# Altium project PCB_Project.PrjPcb
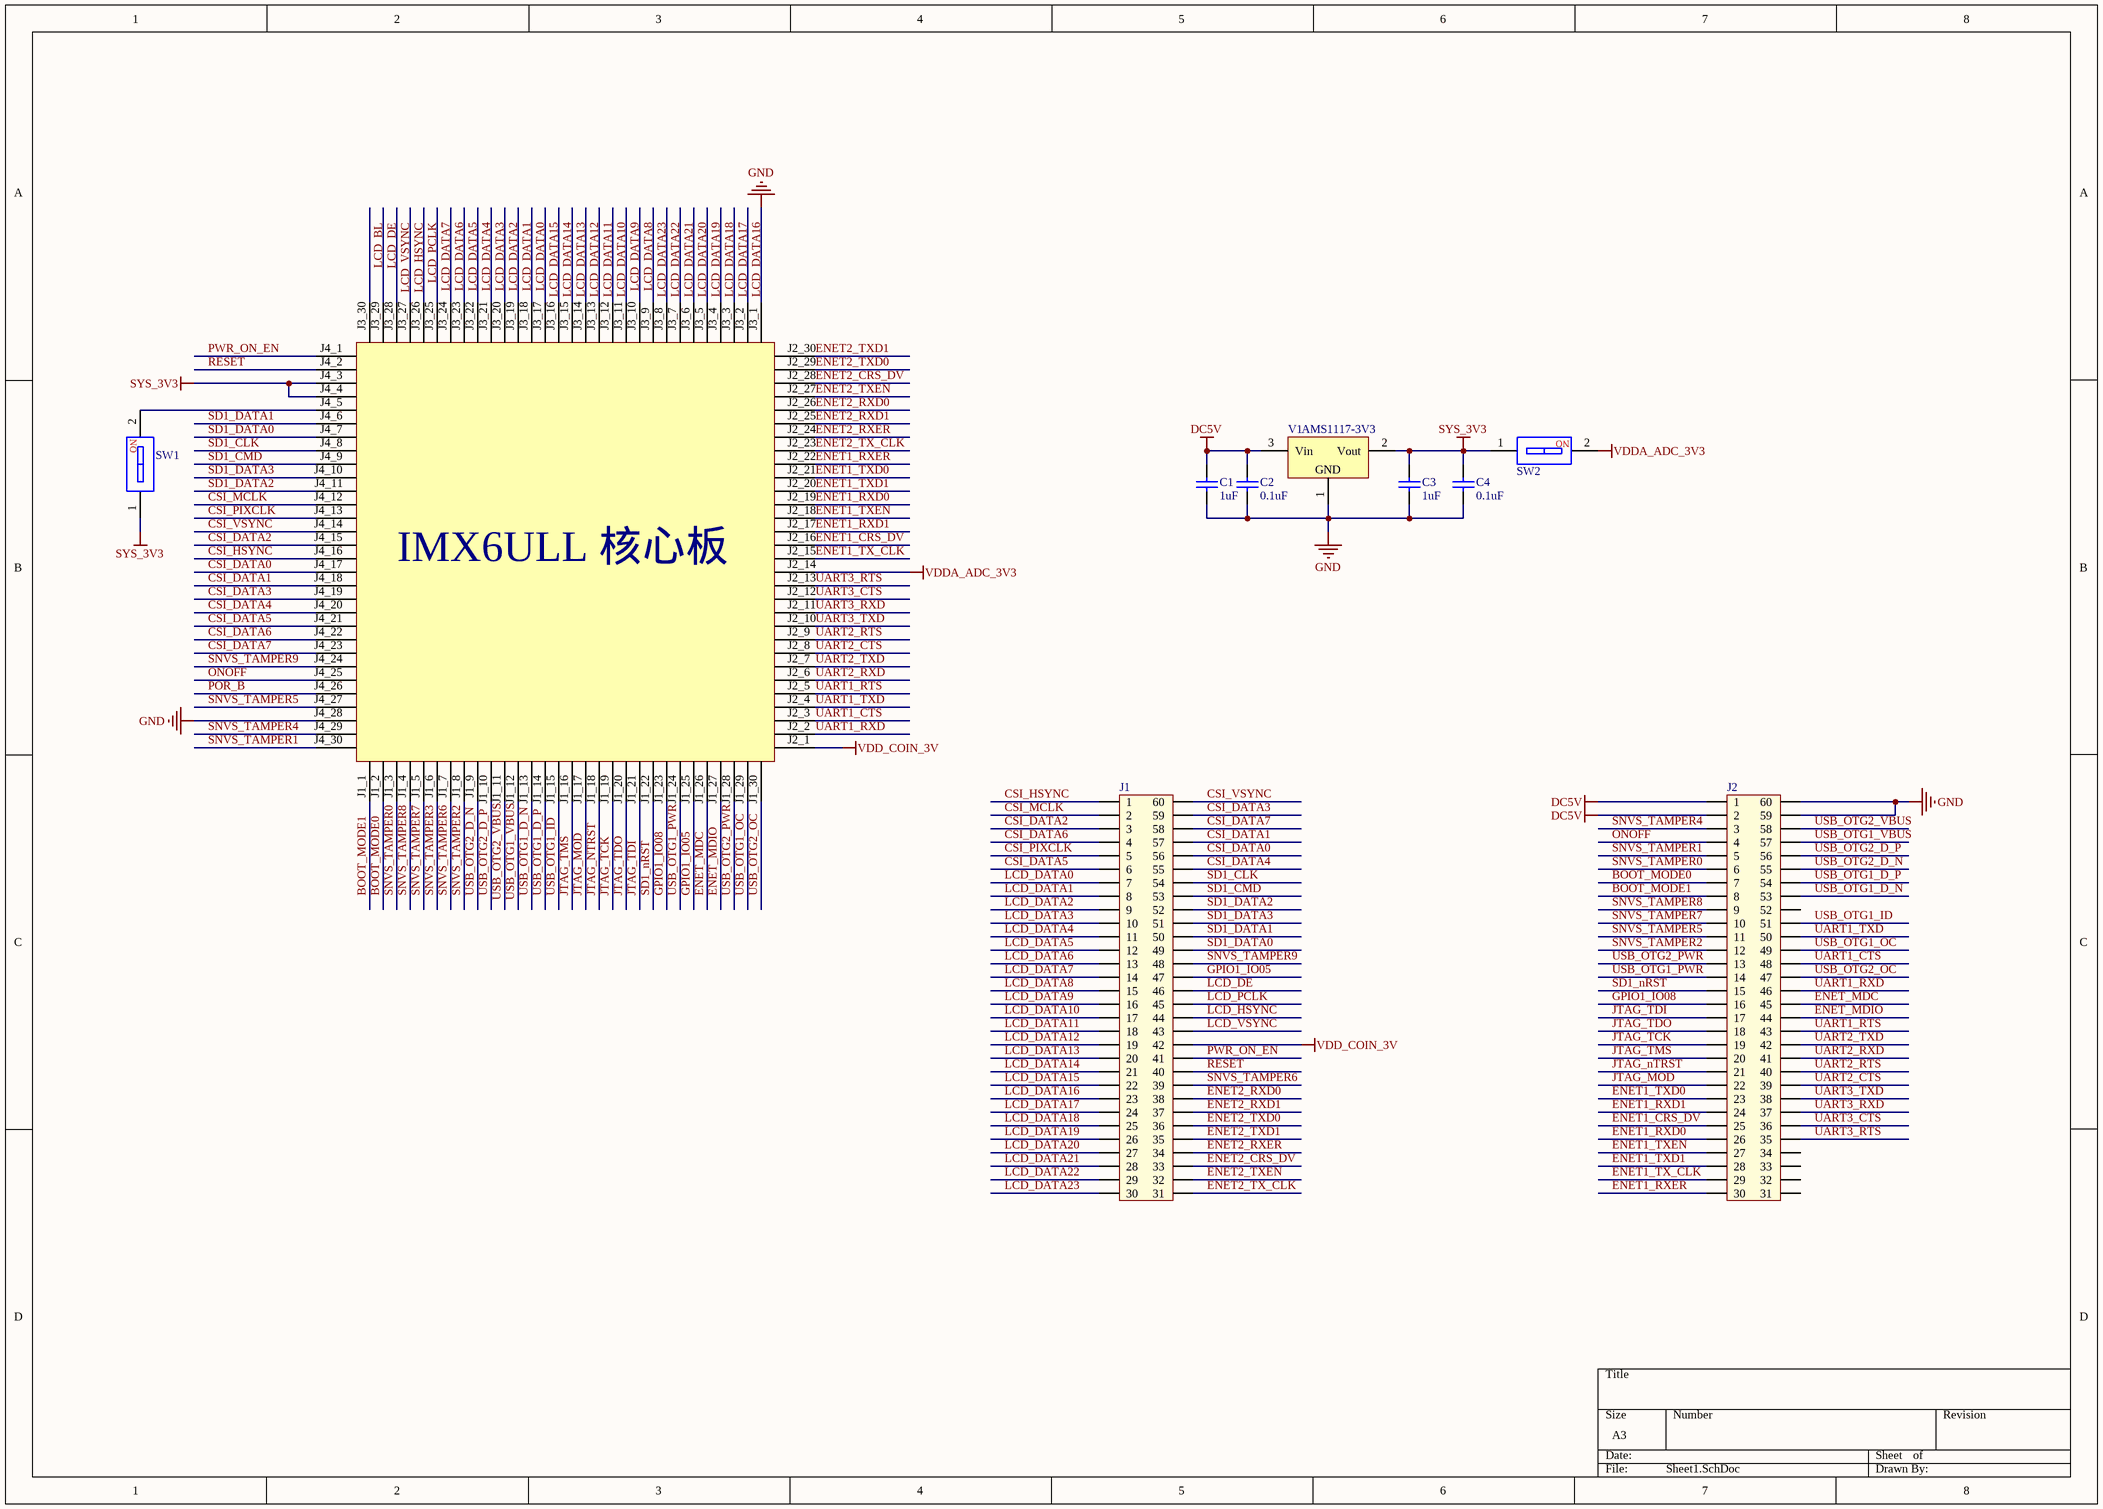
[diagram p0: Sheet1.SchDoc]
1 sheet, 10 parts. Net scope: global (net labels, ports and power ports of the same name join across sheets).
Board file: transfer.PcbDoc

## Sheet Sheet1.SchDoc
size A3; SheetNumber: 1; SheetTotal: 1

### Parts
*  Connector_stamp_imx6ull  [Connector_stamp_imx6ull]  (value not drawn)
C1  1uF  [0603_C_STD]
C2  0.1uF  [0603_C_STD]
C3  1uF  [0603_C_STD]
C4  0.1uF  [0603_C_STD]
J1  3710M060046G3FT01  [3710F060046G3FT01]  (value not drawn)
J2  3710M060046G3FT01  [3710F060046G3FT01]  (value not drawn)
SW1  CSW-1P  [CSW DIP-1P]  (value not drawn)
SW2  CSW-1P  [CSW DIP-1P]  (value not drawn)
V1  AMS1117-3V3  [SOT223_L]

### Nets
DC5V: C1.2 C2.2 J2.1 J2.2 V1.3(Vin)
GND: *.J3_1(J2_31) *.J4_28(J3_58) C1.1 C2.1 C3.1 C4.1 J2.59 J2.60 V1.1(GND)
SYS_3V3: *.J4_3(J3_33) *.J4_4(J3_34) C3.2 C4.2 SW1.1 SW2.1 V1.2(Vout)
VDD_COIN_3V: *.J2_1(J1_31) J1.42
VDDA_ADC_3V3: *.J2_14(J1_44) SW2.2
BOOT_MODE0: *.J1_2 J2.7
BOOT_MODE1: *.J1_1 J2.8
CSI_DATA0: *.J4_17(J3_47) J1.56
CSI_DATA1: *.J4_18(J3_48) J1.57
CSI_DATA2: *.J4_15(J3_45) J1.3
CSI_DATA3: *.J4_19(J3_49) J1.59
CSI_DATA4: *.J4_20(J3_50) J1.55
CSI_DATA5: *.J4_21(J3_51) J1.6
CSI_DATA6: *.J4_22(J3_52) J1.4
CSI_DATA7: *.J4_23(J3_53) J1.58
CSI_HSYNC: *.J4_16(J3_46) J1.1
CSI_MCLK: *.J4_12(J3_42) J1.2
CSI_PIXCLK: *.J4_13(J3_43) J1.5
CSI_VSYNC: *.J4_14(J3_44) J1.60
ENET1_CRS_DV: *.J2_16(J1_46) J2.25
ENET1_RXD0: *.J2_19(J1_49) J2.26
ENET1_RXD1: *.J2_17(J1_47) J2.24
ENET1_RXER: *.J2_22(J1_52) J2.30
ENET1_TX_CLK: *.J2_15(J1_45) J2.29
ENET1_TXD0: *.J2_21(J1_51) J2.23
ENET1_TXD1: *.J2_20(J1_50) J2.28
ENET1_TXEN: *.J2_18(J1_48) J2.27
ENET2_CRS_DV: *.J2_28(J1_58) J1.33
ENET2_RXD0: *.J2_26(J1_56) J1.38
ENET2_RXD1: *.J2_25(J1_55) J1.37
ENET2_RXER: *.J2_24(J1_54) J1.34
ENET2_TX_CLK: *.J2_23(J1_53) J1.31
ENET2_TXD0: *.J2_29(J1_59) J1.36
ENET2_TXD1: *.J2_30(J1_60) J1.35
ENET2_TXEN: *.J2_27(J1_57) J1.32
ENET_MDC: *.J1_26 J2.45
ENET_MDIO: *.J1_27 J2.44
GPIO1_IO05: *.J1_25 J1.47
GPIO1_IO08: *.J1_23 J2.16
JTAG_MOD: *.J1_17 J2.22
JTAG_NTRST: *.J1_18 J2.21
JTAG_TCK: *.J1_19 J2.19
JTAG_TDI: *.J1_21 J2.17
JTAG_TDO: *.J1_20 J2.18
JTAG_TMS: *.J1_16 J2.20
LCD_BL: *.J3_30(J2_60)
LCD_DATA0: *.J3_18(J2_48) J1.7
LCD_DATA1: *.J3_19(J2_49) J1.8
LCD_DATA2: *.J3_20(J2_50) J1.9
LCD_DATA3: *.J3_21(J2_51) J1.10
LCD_DATA4: *.J3_22(J2_52) J1.11
LCD_DATA5: *.J3_23(J2_53) J1.12
LCD_DATA6: *.J3_24(J2_54) J1.13
LCD_DATA7: *.J3_25(J2_55) J1.14
LCD_DATA8: *.J3_10(J2_40) J1.15
LCD_DATA9: *.J3_11(J2_41) J1.16
LCD_DATA10: *.J3_12(J2_42) J1.17
LCD_DATA11: *.J3_13(J2_43) J1.18
LCD_DATA12: *.J3_14(J2_44) J1.19
LCD_DATA13: *.J3_15(J2_45) J1.20
LCD_DATA14: *.J3_16(J2_46) J1.21
LCD_DATA15: *.J3_17(J2_47) J1.22
LCD_DATA16: *.J3_2(J2_32) J1.23
LCD_DATA17: *.J3_3(J2_33) J1.24
LCD_DATA18: *.J3_4(J2_34) J1.25
LCD_DATA19: *.J3_5(J2_35) J1.26
LCD_DATA20: *.J3_6(J2_36) J1.27
LCD_DATA21: *.J3_7(J2_37) J1.28
LCD_DATA22: *.J3_8(J2_38) J1.29
LCD_DATA23: *.J3_9(J2_39) J1.30
LCD_DE: *.J3_29(J2_59) J1.46
LCD_HSYNC: *.J3_27(J2_57) J1.44
LCD_PCLK: *.J3_26(J2_56) J1.45
LCD_VSYNC: *.J3_28(J2_58) J1.43
ONOFF: *.J4_25(J3_55) J2.4
POR_B: *.J4_26(J3_56)
PWR_ON_EN: *.J4_1(J3_31) J1.41
RESET: *.J4_2(J3_32) J1.40
SD1_CLK: *.J4_8(J3_38) J1.54
SD1_CMD: *.J4_9(J3_39) J1.53
SD1_DATA0: *.J4_7(J3_37) J1.49
SD1_DATA1: *.J4_6(J3_36) J1.50
SD1_DATA2: *.J4_11(J3_41) J1.52
SD1_DATA3: *.J4_10(J3_40) J1.51
SD1_nRST: *.J1_22 J2.15
SNVS_TAMPER0: *.J1_3 J2.6
SNVS_TAMPER1: *.J4_30(J3_60) J2.5
SNVS_TAMPER2: *.J1_8 J2.12
SNVS_TAMPER3: *.J1_6
SNVS_TAMPER4: *.J4_29(J3_59) J2.3
SNVS_TAMPER5: *.J4_27(J3_57) J2.11
SNVS_TAMPER6: *.J1_7 J1.39
SNVS_TAMPER7: *.J1_5 J2.10
SNVS_TAMPER8: *.J1_4 J2.9
SNVS_TAMPER9: *.J4_24(J3_54) J1.48
UART1_CTS: *.J2_3(J1_33) J2.48
UART1_RTS: *.J2_5(J1_35) J2.43
UART1_RXD: *.J2_2(J1_32) J2.46
UART1_TXD: *.J2_4(J1_34) J2.50
UART2_CTS: *.J2_8(J1_38) J2.39
UART2_RTS: *.J2_9(J1_39) J2.40
UART2_RXD: *.J2_6(J1_36) J2.41
UART2_TXD: *.J2_7(J1_37) J2.42
UART3_CTS: *.J2_12(J1_42) J2.36
UART3_RTS: *.J2_13(J1_43) J2.35
UART3_RXD: *.J2_11(J1_41) J2.37
UART3_TXD: *.J2_10(J1_40) J2.38
USB_OTG1_D_N: *.J1_13 J2.53
USB_OTG1_D_P: *.J1_14 J2.54
USB_OTG1_ID: *.J1_15 J2.51
USB_OTG1_OC: *.J1_29 J2.49
USB_OTG1_PWR: *.J1_24 J2.14
USB_OTG1_VBUS: *.J1_12 J2.57
USB_OTG2_D_N: *.J1_9 J2.55
USB_OTG2_D_P: *.J1_10 J2.56
USB_OTG2_OC: *.J1_30 J2.47
USB_OTG2_PWR: *.J1_28 J2.13
USB_OTG2_VBUS: *.J1_11 J2.58
Net*_J4_5: *.J4_5(J3_35) SW1.2

Not connected (* = marked no-connect by the designer): J2 31 32 33 34 52

### Notes on the sheet
- (in symbol Connector_stamp_imx6ull) IMX6ULL 核心板
- (in symbol CSW-1P) NO

### Library data of the parts
C1-C4 = 0603_C_STD: 贴片电容; ComponentLink1Description: 供应商链接; ComponentLink1URL: http://www.szlcsc.com/product/details_2037.html; Package: 0603; Supplier: LC; SuppliersPartNumber: C1685
J1 J2 = 3710F: 3710F060046G3FT01
SW1 SW2 = CSW-1P: 1路编码开关; 版权归属: 源创客; BOM名称: 1路编码开关; 学习资源: www.ooocke.com
V1 = AMS1117: 三端稳压芯片; BOM名称: 稳压芯片; 版权归属: 源创客; 学习资源: www.ooocke.com